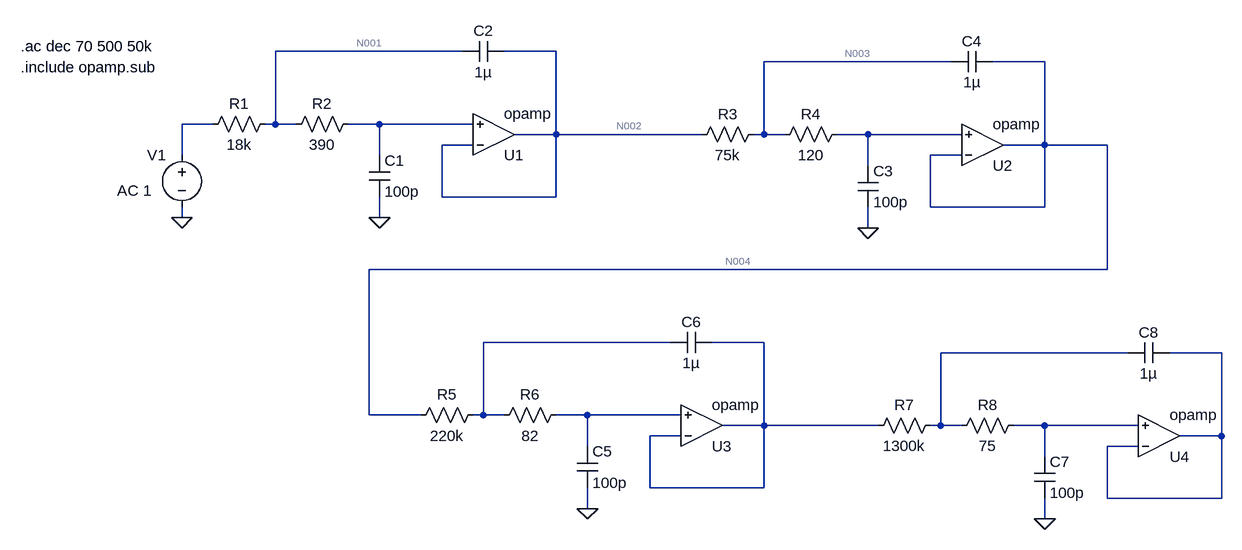
[diagram p0: schematic 8th_Order_LP_Cheyshev.asc]
8th_Order_LP_Cheyshev.asc, the LTspice schematic file:
Version 4
SHEET 1 1640 708
WIRE 464 -32 176 -32
WIRE 608 -32 528 -32
WIRE 1216 -16 928 -16
WIRE 1360 -16 1280 -16
WIRE 80 80 32 80
WIRE 176 80 176 -32
WIRE 176 80 160 80
WIRE 208 80 176 80
WIRE 336 80 288 80
WIRE 480 80 336 80
WIRE 608 96 608 -32
WIRE 608 96 544 96
WIRE 832 96 608 96
WIRE 928 96 928 -16
WIRE 928 96 912 96
WIRE 960 96 928 96
WIRE 1088 96 1040 96
WIRE 1232 96 1088 96
WIRE 480 112 432 112
WIRE 1360 112 1360 -16
WIRE 1360 112 1296 112
WIRE 1456 112 1360 112
WIRE 32 128 32 80
WIRE 336 128 336 80
WIRE 1232 128 1184 128
WIRE 1088 144 1088 96
WIRE 432 192 432 112
WIRE 608 192 608 96
WIRE 608 192 432 192
WIRE 1184 208 1184 128
WIRE 1360 208 1360 112
WIRE 1360 208 1184 208
WIRE 32 224 32 208
WIRE 336 224 336 192
WIRE 1088 240 1088 208
WIRE 1456 304 1456 112
WIRE 1456 304 320 304
WIRE 784 416 496 416
WIRE 928 416 848 416
WIRE 1488 432 1200 432
WIRE 1632 432 1552 432
WIRE 320 528 320 304
WIRE 400 528 320 528
WIRE 496 528 496 416
WIRE 496 528 480 528
WIRE 528 528 496 528
WIRE 656 528 608 528
WIRE 800 528 656 528
WIRE 928 544 928 416
WIRE 928 544 864 544
WIRE 1104 544 928 544
WIRE 1200 544 1200 432
WIRE 1200 544 1184 544
WIRE 1232 544 1200 544
WIRE 1360 544 1312 544
WIRE 1504 544 1360 544
WIRE 800 560 752 560
WIRE 1632 560 1632 432
WIRE 1632 560 1568 560
WIRE 656 576 656 528
WIRE 1504 576 1456 576
WIRE 1360 592 1360 544
WIRE 752 640 752 560
WIRE 928 640 928 544
WIRE 928 640 752 640
WIRE 1456 656 1456 576
WIRE 1632 656 1632 560
WIRE 1632 656 1456 656
WIRE 656 672 656 640
WIRE 1360 688 1360 656
FLAG 32 224 0
FLAG 336 224 0
FLAG 1088 240 0
FLAG 656 672 0
FLAG 1360 688 0
SYMBOL res 176 64 R90
WINDOW 0 0 56 VBottom 2
WINDOW 3 32 56 VTop 2
SYMATTR InstName R1
SYMATTR Value 18k
SYMBOL res 304 64 R90
WINDOW 0 0 56 VBottom 2
WINDOW 3 32 56 VTop 2
SYMATTR InstName R2
SYMATTR Value 390
SYMBOL cap 320 128 R0
SYMATTR InstName C1
SYMATTR Value 100p
SYMBOL cap 528 -48 R90
WINDOW 0 0 32 VBottom 2
WINDOW 3 32 32 VTop 2
SYMATTR InstName C2
SYMATTR Value 1µ
SYMBOL voltage 32 112 M0
WINDOW 3 50 68 Left 2
WINDOW 123 46 70 Left 2
WINDOW 39 0 0 Left 0
SYMATTR Value ""
SYMATTR Value2 AC 1
SYMATTR InstName V1
SYMBOL Opamps\\opamp 512 160 M180
SYMATTR InstName U1
SYMBOL res 928 80 R90
WINDOW 0 0 56 VBottom 2
WINDOW 3 32 56 VTop 2
SYMATTR InstName R3
SYMATTR Value 75k
SYMBOL res 1056 80 R90
WINDOW 0 0 56 VBottom 2
WINDOW 3 32 56 VTop 2
SYMATTR InstName R4
SYMATTR Value 120
SYMBOL cap 1072 144 R0
SYMATTR InstName C3
SYMATTR Value 100p
SYMBOL cap 1280 -32 R90
WINDOW 0 0 32 VBottom 2
WINDOW 3 32 32 VTop 2
SYMATTR InstName C4
SYMATTR Value 1µ
SYMBOL Opamps\\opamp 1264 176 M180
SYMATTR InstName U2
SYMBOL res 496 512 R90
WINDOW 0 0 56 VBottom 2
WINDOW 3 32 56 VTop 2
SYMATTR InstName R5
SYMATTR Value 220k
SYMBOL res 624 512 R90
WINDOW 0 0 56 VBottom 2
WINDOW 3 32 56 VTop 2
SYMATTR InstName R6
SYMATTR Value 82
SYMBOL cap 640 576 R0
SYMATTR InstName C5
SYMATTR Value 100p
SYMBOL cap 848 400 R90
WINDOW 0 0 32 VBottom 2
WINDOW 3 32 32 VTop 2
SYMATTR InstName C6
SYMATTR Value 1µ
SYMBOL Opamps\\opamp 832 608 M180
SYMATTR InstName U3
SYMBOL res 1200 528 R90
WINDOW 0 0 56 VBottom 2
WINDOW 3 32 56 VTop 2
SYMATTR InstName R7
SYMATTR Value 1300k
SYMBOL res 1328 528 R90
WINDOW 0 0 56 VBottom 2
WINDOW 3 32 56 VTop 2
SYMATTR InstName R8
SYMATTR Value 75
SYMBOL cap 1344 592 R0
SYMATTR InstName C7
SYMATTR Value 100p
SYMBOL cap 1552 416 R90
WINDOW 0 0 32 VBottom 2
WINDOW 3 32 32 VTop 2
SYMATTR InstName C8
SYMATTR Value 1µ
SYMBOL Opamps\\opamp 1536 624 M180
SYMATTR InstName U4
TEXT -216 -40 Left 2 !.ac dec 70 500 50k
TEXT -216 -8 Left 2 !.include opamp.sub

The netlist it stands for:
* 8th_Order_LP_Cheyshev.asc
R1 N001 N005 18k
R2 N006 N001 390
C1 N006 0 100p
C2 N002 N001 1µ
V1 N005 0 AC 1
XU1 N002 N006 N002 opamp Aol=100K GBW=10Meg  ; pins invin noninvin out
R3 N003 N002 75k
R4 N007 N003 120
C3 N007 0 100p
C4 N004 N003 1µ
XU2 N004 N007 N004 opamp Aol=100K GBW=10Meg  ; pins invin noninvin out
R5 N008 N004 220k
R6 N012 N008 82
C5 N012 0 100p
C6 N009 N008 1µ
XU3 N009 N012 N009 opamp Aol=100K GBW=10Meg  ; pins invin noninvin out
R7 N010 N009 1300k
R8 N013 N010 75
C7 N013 0 100p
C8 N011 N010 1µ
XU4 N011 N013 N011 opamp Aol=100K GBW=10Meg  ; pins invin noninvin out
.ac dec 70 500 50k
.include opamp.sub
.backanno
.end

* Results of the author's LTspice run, read from the files saved beside the schematic
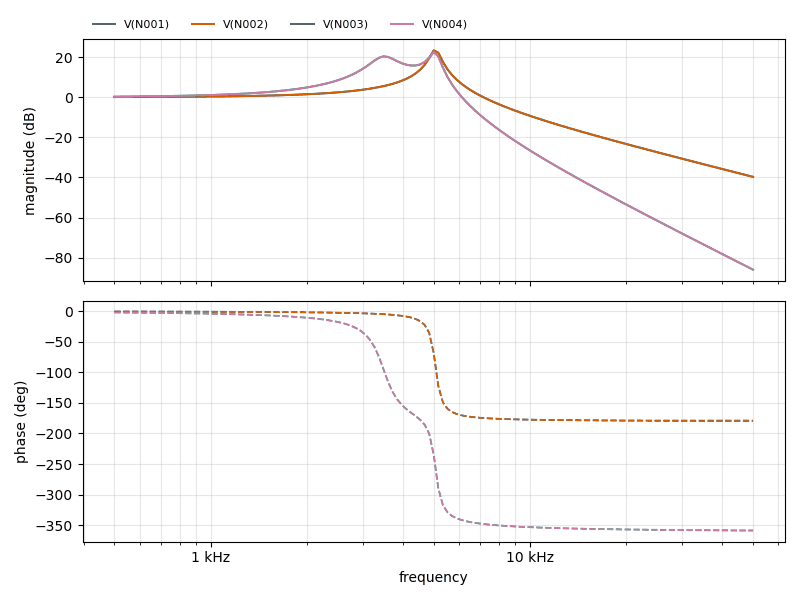
[diagram p1: AC Analysis of 8th_Order_LP_Cheyshev.asc, plotted from the saved traces]
* AC Analysis, 1 run:
*   V(N001): 0.08 dB at 500 Hz, -39.70 dB at 50 kHz, peak 23.34 dB at 5 kHz, 3 dB below the peak at 4.873 kHz and 5.236 kHz
*   V(N002): 0.08 dB at 500 Hz, -39.70 dB at 50 kHz, peak 23.34 dB at 5 kHz, 3 dB below the peak at 4.873 kHz and 5.236 kHz
*   V(N003): 0.26 dB at 500 Hz, -85.96 dB at 50 kHz, peak 22.53 dB at 5 kHz, 3 dB below the peak at 4.821 kHz and 5.192 kHz
*   V(N004): 0.26 dB at 500 Hz, -85.96 dB at 50 kHz, peak 22.53 dB at 5 kHz, 3 dB below the peak at 4.821 kHz and 5.192 kHz